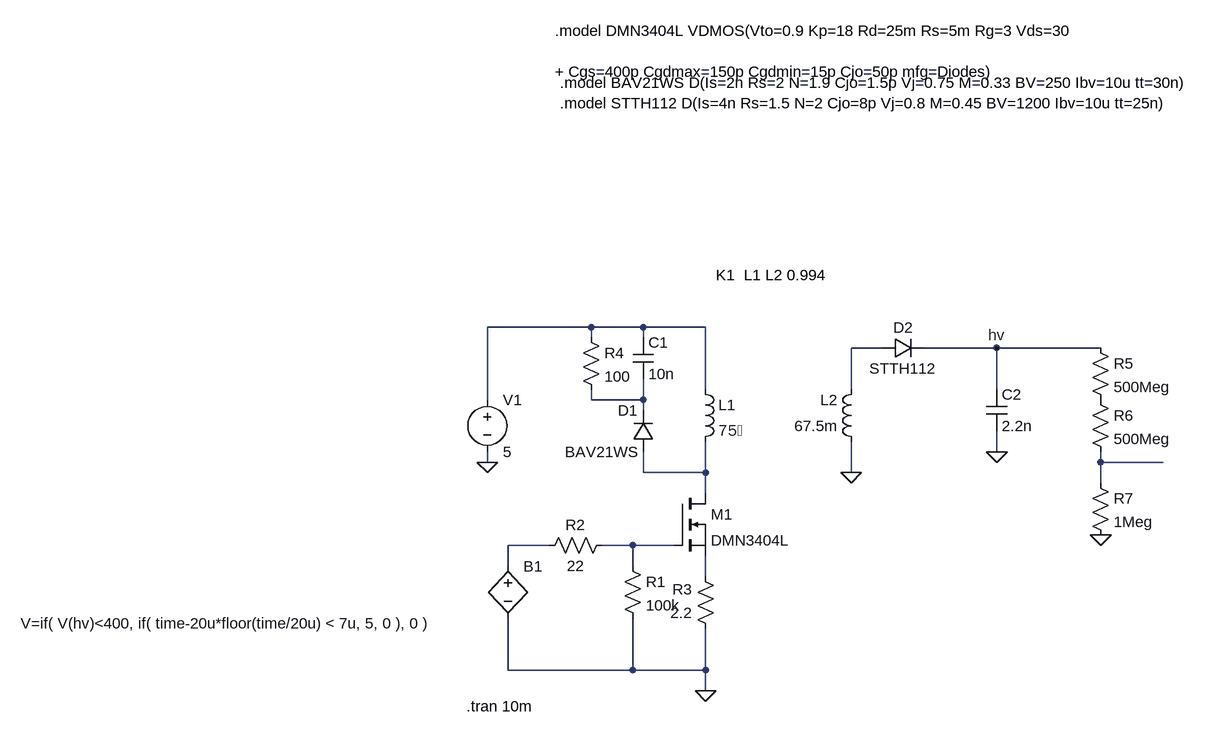
[diagram p0: schematic HV_flyback.asc]
HV_flyback.asc, the LTspice schematic file:
Version 4.1
SHEET 1 896 680
WIRE -128 0 -288 0
WIRE -48 0 -128 0
WIRE 48 0 -48 0
WIRE -128 16 -128 0
WIRE -48 16 -48 0
WIRE 320 32 272 32
WIRE 496 32 384 32
WIRE 656 32 496 32
WIRE 48 96 48 0
WIRE 272 96 272 32
WIRE 496 96 496 32
WIRE -288 112 -288 0
WIRE -128 112 -128 96
WIRE -48 112 -48 80
WIRE -48 112 -128 112
WIRE -48 128 -48 112
WIRE 496 192 496 160
WIRE -288 208 -288 192
WIRE 656 208 656 192
WIRE 752 208 656 208
WIRE -48 224 -48 192
WIRE 48 224 48 176
WIRE 48 224 -48 224
WIRE 272 224 272 176
WIRE 656 240 656 208
WIRE 48 256 48 224
WIRE -192 336 -256 336
WIRE -64 336 -112 336
WIRE 0 336 -64 336
WIRE -256 368 -256 336
WIRE -64 368 -64 336
WIRE 48 384 48 352
WIRE -256 528 -256 448
WIRE -64 528 -64 448
WIRE -64 528 -256 528
WIRE 48 528 48 464
WIRE 48 528 -64 528
WIRE 48 560 48 528
FLAG -288 208 0
FLAG 48 560 0
FLAG 272 224 0
FLAG 496 192 0
FLAG 656 320 0
FLAG 496 32 hv
SYMBOL ind 32 80 R0
SYMATTR InstName L1
SYMATTR Value 75�
SYMATTR Type ind
SYMATTR SpiceLine Rser=1m
SYMBOL ind 288 192 R180
WINDOW 0 36 80 Left 2
WINDOW 3 36 40 Left 2
SYMATTR InstName L2
SYMATTR Value 67.5m
SYMATTR Type ind
SYMATTR SpiceLine Rser=1m
SYMBOL voltage -288 96 R0
WINDOW 123 0 0 Left 0
WINDOW 39 0 0 Left 0
SYMATTR InstName V1
SYMATTR Value 5
SYMBOL nmos 0 256 R0
SYMATTR InstName M1
SYMATTR Value DMN3404L
SYMBOL res -80 352 R0
SYMATTR InstName R1
SYMATTR Value 100k
SYMBOL res -96 320 R90
WINDOW 0 0 56 VBottom 2
WINDOW 3 32 56 VTop 2
SYMATTR InstName R2
SYMATTR Value 22
SYMBOL res 64 480 R180
WINDOW 0 36 76 Left 2
WINDOW 3 36 40 Left 2
SYMATTR InstName R3
SYMATTR Value 2.2
SYMBOL res -144 0 R0
SYMATTR InstName R4
SYMATTR Value 100
SYMBOL cap -64 16 R0
SYMATTR InstName C1
SYMATTR Value 10n
SYMBOL diode -32 192 R180
WINDOW 0 24 64 Left 2
WINDOW 3 24 0 Left 2
SYMATTR InstName D1
SYMATTR Value BAV21WS
SYMBOL diode 320 48 R270
WINDOW 0 32 32 VTop 2
WINDOW 3 0 32 VBottom 2
SYMATTR InstName D2
SYMATTR Value STTH112
SYMBOL cap 480 96 R0
SYMATTR InstName C2
SYMATTR Value 2.2n
SYMATTR SpiceLine V=1k
SYMBOL res 640 16 R0
SYMATTR InstName R5
SYMATTR Value 500Meg
SYMBOL res 640 96 R0
SYMATTR InstName R6
SYMATTR Value 500Meg
SYMBOL res 640 224 R0
SYMATTR InstName R7
SYMATTR Value 1Meg
SYMBOL bv -256 352 R0
WINDOW 3 -750 104 Left 2
SYMATTR Value V=if( V(hv)<400, if( time-20u*floor(time/20u) < 7u, 5, 0 ), 0 )
SYMATTR InstName B1
TEXT -184 -456 Left 2 !.model DMN3404L VDMOS(Vto=0.9 Kp=18 Rd=25m Rs=5m Rg=3 Vds=30\n\n+ Cgs=400p Cgdmax=150p Cgdmin=15p Cjo=50p mfg=Diodes)
TEXT 64 -80 Left 2 !K1  L1 L2 0.994
TEXT -176 -376 Left 2 !.model BAV21WS D(Is=2n Rs=2 N=1.9 Cjo=1.5p Vj=0.75 M=0.33 BV=250 Ibv=10u tt=30n)\n.model STTH112 D(Is=4n Rs=1.5 N=2 Cjo=8p Vj=0.8 M=0.45 BV=1200 Ibv=10u tt=25n)
TEXT -320 584 Left 2 !.tran 10m

The netlist it stands for:
* HV_flyback.asc
L1 N001 N005 75� Rser=1m
L2 0 N002 67.5m Rser=1m
V1 N001 0 5
M1 N005 N007 N008 N008 DMN3404L
R1 N007 0 100k
R2 N007 N006 22
R3 0 N008 2.2
R4 N001 N003 100
C1 N001 N003 10n
D1 N005 N003 BAV21WS
D2 N002 hv STTH112
C2 hv 0 2.2n V=1k
R5 hv P001 500Meg
R6 P001 N004 500Meg
R7 N004 0 1Meg
B1 N006 0 V=if( V(hv)<400, if( time-20u*floor(time/20u) < 7u, 5, 0 ), 0 )
.model D D
.lib standard.dio
.model NMOS NMOS
.model PMOS PMOS
.lib standard.mos
.model DMN3404L VDMOS(Vto=0.9 Kp=18 Rd=25m Rs=5m Rg=3 Vds=30
+ Cgs=400p Cgdmax=150p Cgdmin=15p Cjo=50p mfg=Diodes)
K1  L1 L2 0.994
.model BAV21WS D(Is=2n Rs=2 N=1.9 Cjo=1.5p Vj=0.75 M=0.33 BV=250 Ibv=10u tt=30n)
.model STTH112 D(Is=4n Rs=1.5 N=2 Cjo=8p Vj=0.8 M=0.45 BV=1200 Ibv=10u tt=25n)
.tran 10m
.backanno
.end